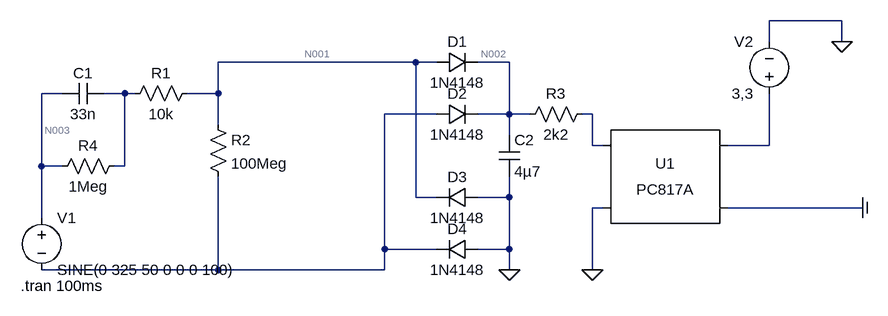
[diagram p0: schematic Detektor_230V.asc]
Detektor_230V.asc, the LTspice schematic file:
Version 4
SHEET 1 1784 680
WIRE 1280 -192 1168 -192
WIRE 1168 -160 1168 -192
WIRE 1280 -160 1280 -192
WIRE 624 -128 320 -128
WIRE 656 -128 624 -128
WIRE 768 -128 720 -128
WIRE 80 -80 48 -80
WIRE 176 -80 144 -80
WIRE 192 -80 176 -80
WIRE 320 -80 320 -128
WIRE 320 -80 272 -80
WIRE 656 -48 576 -48
WIRE 768 -48 768 -128
WIRE 768 -48 720 -48
WIRE 800 -48 768 -48
WIRE 896 -48 880 -48
WIRE 320 -32 320 -80
WIRE 768 -16 768 -48
WIRE 896 0 896 -48
WIRE 912 0 896 0
WIRE 1168 0 1168 -80
WIRE 1168 0 1104 0
WIRE 48 32 48 -80
WIRE 80 32 48 32
WIRE 176 32 176 -80
WIRE 176 32 160 32
WIRE 624 80 624 -128
WIRE 656 80 624 80
WIRE 768 80 768 48
WIRE 768 80 720 80
WIRE 912 96 896 96
WIRE 1312 96 1104 96
WIRE 48 112 48 32
WIRE 576 160 576 -48
WIRE 656 160 576 160
WIRE 768 160 768 80
WIRE 768 160 720 160
WIRE 320 192 320 48
WIRE 320 192 48 192
WIRE 576 192 576 160
WIRE 576 192 320 192
WIRE 768 192 768 160
WIRE 896 192 896 96
FLAG 768 192 0
FLAG 896 192 0
FLAG 1280 -160 0
FLAG 1312 96 COM
IOPIN 1312 96 Out
SYMBOL voltage 48 96 R0
WINDOW 123 0 0 Left 0
WINDOW 39 0 0 Left 0
SYMATTR InstName V1
SYMATTR Value SINE(0 325 50 0 0 0 100)
SYMBOL cap 144 -96 R90
WINDOW 0 0 32 VBottom 2
WINDOW 3 32 32 VTop 2
SYMATTR InstName C1
SYMATTR Value 33n
SYMBOL res 288 -96 R90
WINDOW 0 0 56 VBottom 2
WINDOW 3 32 56 VTop 2
SYMATTR InstName R1
SYMATTR Value 10k
SYMBOL res 304 -48 R0
SYMATTR InstName R2
SYMATTR Value 100Meg
SYMBOL diode 656 -112 R270
WINDOW 0 32 32 VTop 2
WINDOW 3 0 32 VBottom 2
SYMATTR InstName D1
SYMATTR Value 1N4148
SYMBOL diode 656 -32 R270
WINDOW 0 32 32 VTop 2
WINDOW 3 0 32 VBottom 2
SYMATTR InstName D2
SYMATTR Value 1N4148
SYMBOL diode 720 64 R90
WINDOW 0 0 32 VBottom 2
WINDOW 3 32 32 VTop 2
SYMATTR InstName D3
SYMATTR Value 1N4148
SYMBOL diode 720 144 R90
WINDOW 0 0 32 VBottom 2
WINDOW 3 32 32 VTop 2
SYMATTR InstName D4
SYMATTR Value 1N4148
SYMBOL cap 752 -16 R0
SYMATTR InstName C2
SYMATTR Value 4µ7
SYMBOL res 896 -64 R90
WINDOW 0 0 56 VBottom 2
WINDOW 3 32 56 VTop 2
SYMATTR InstName R3
SYMATTR Value 2k2
SYMBOL res 176 16 R90
WINDOW 0 0 56 VBottom 2
WINDOW 3 32 56 VTop 2
SYMATTR InstName R4
SYMATTR Value 1Meg
SYMBOL Optos\\PC817A 1008 48 R0
SYMATTR InstName U1
SYMBOL voltage 1168 -64 R180
WINDOW 0 24 96 Left 2
WINDOW 3 24 16 Left 2
WINDOW 123 0 0 Left 0
WINDOW 39 0 0 Left 0
SYMATTR InstName V2
SYMATTR Value 3,3
TEXT 16 216 Left 2 !.tran 100ms

The netlist it stands for:
* Detektor_230V.asc
V1 N003 N005 SINE(0 325 50 0 0 0 100)
C1 N004 N003 33n
R1 N001 N004 10k
R2 N001 N005 100Meg
D1 N001 N002 1N4148
D2 N005 N002 1N4148
D3 0 N001 1N4148
D4 0 N005 1N4148
C2 N002 0 4µ7
R3 N006 N002 2k2
R4 N004 N003 1Meg
XU1 N006 0 N007 COM PC817 Igain=1m
V2 N007 0 3,3
.model D D
.lib standard.dio
.tran 100ms
.lib PC817.sub
.backanno
.end

* Results of the author's LTspice run, read from the files saved beside the schematic
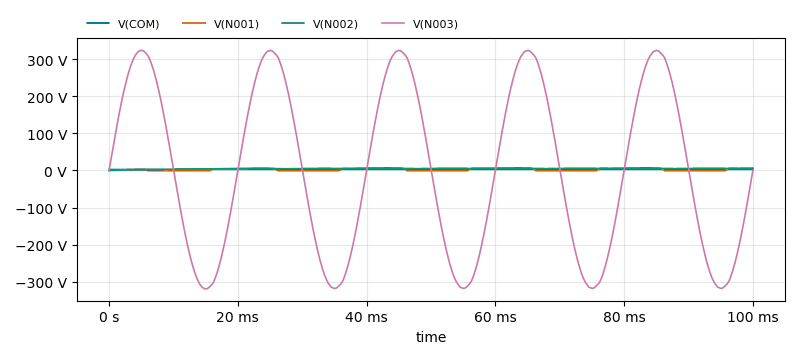
[diagram p1: Transient Analysis of Detektor_230V.asc, plotted from the saved traces]
* Transient Analysis, 1 run:
*   V(COM): min 2.997 V, max 3.234 V, average 3.001 V, rms 3.001 V, last 3 V
*   V(N001): min -640.4 mV, max 6.693 V, average 2.436 V, rms 3.977 V, last 6.134 V
*   V(N002): min 0 V, max 6.07 V, average 4.992 V, rms 5.134 V, last 5.495 V
*   V(N003): min -319.5 V, max 324.4 V, average 2.554 V, rms 228.7 V, last -639.5 mV